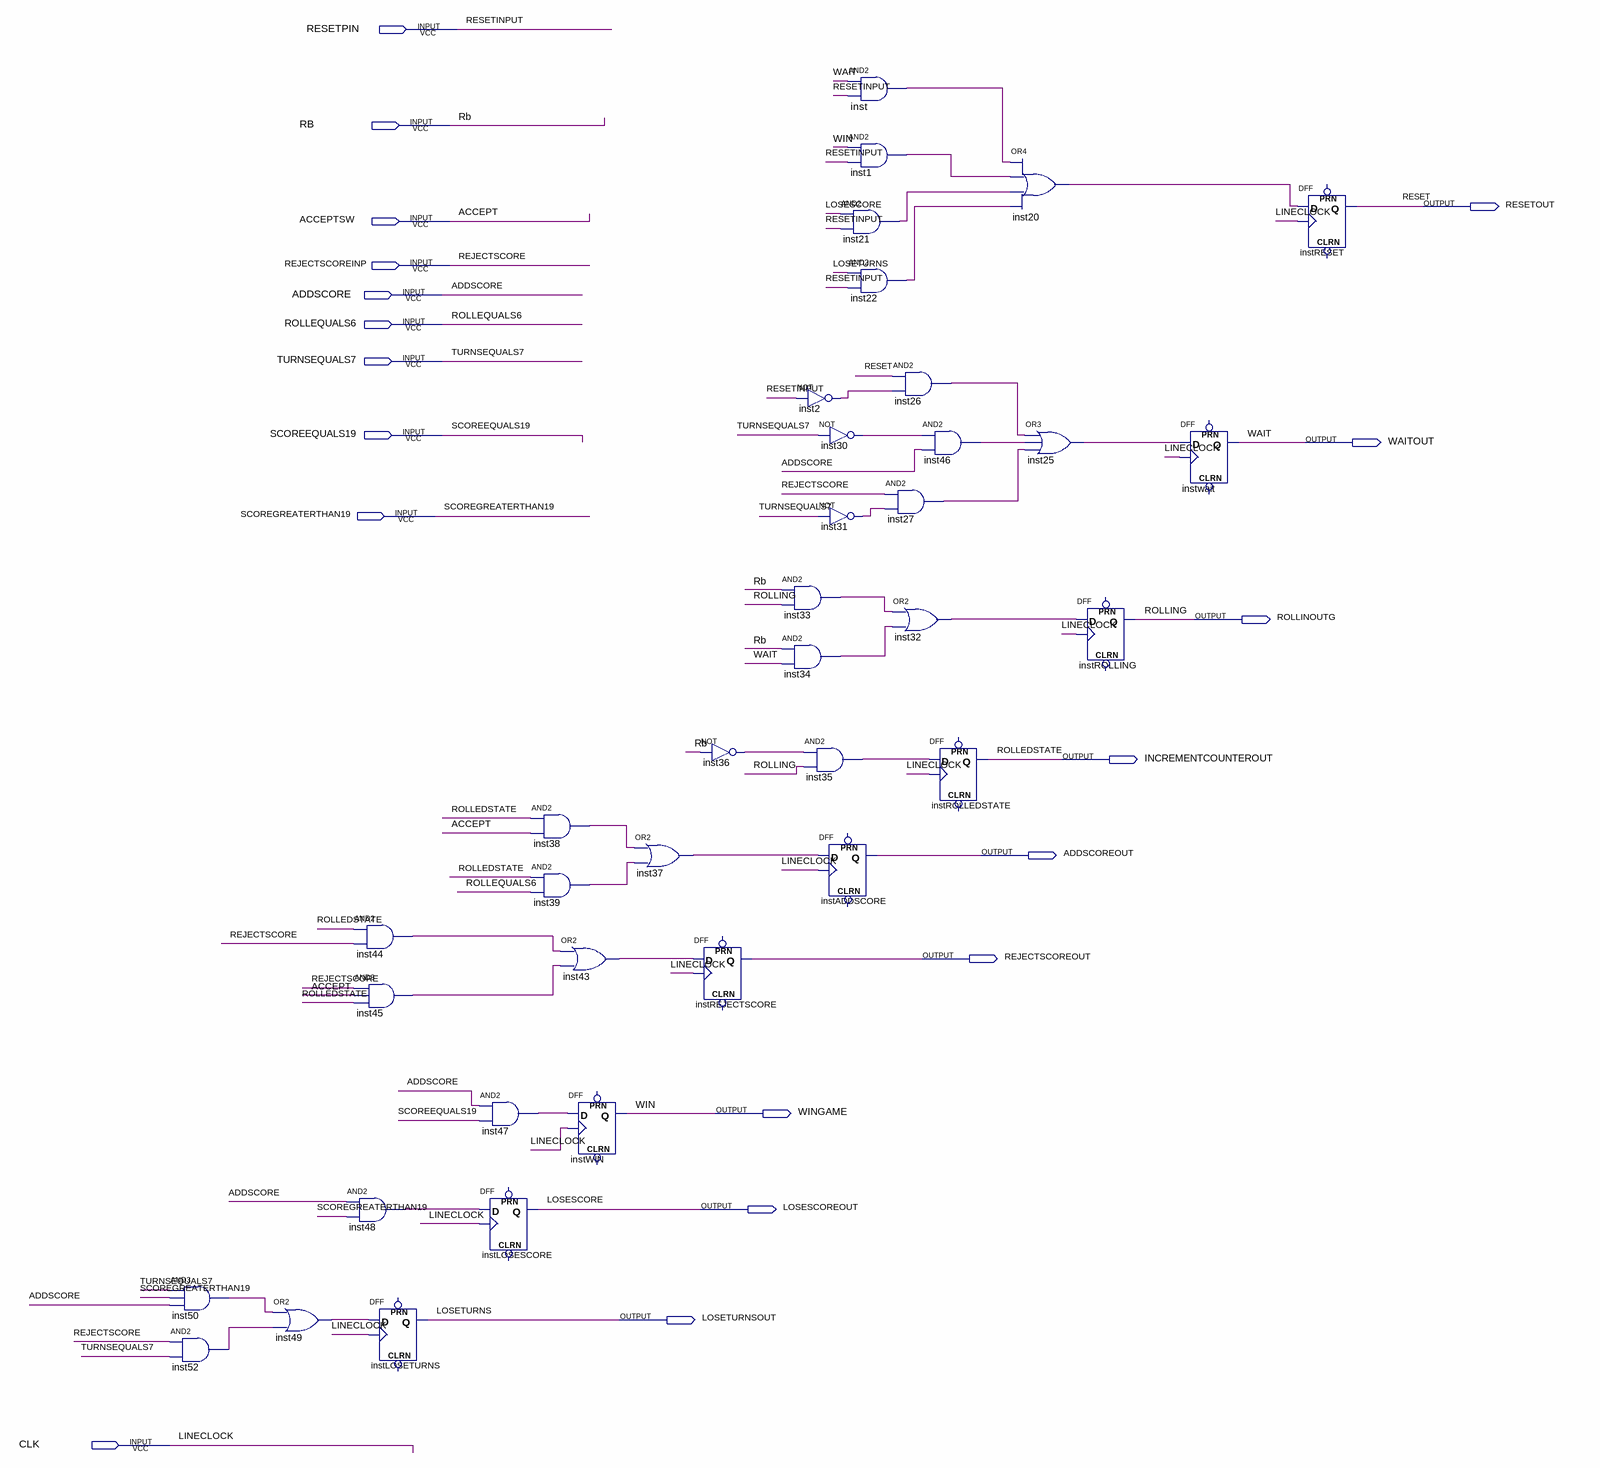
[diagram p0: schematic sheet]
// Quartus schematic Control.bdf as structural Verilog: 37 symbols, 19 pins
module Control (
  input  RESETPIN,
  input  RB,
  input  ACCEPTSW,
  input  REJECTSCOREINP,
  input  ADDSCORE,
  input  ROLLEQUALS6,
  input  TURNSEQUALS7,
  input  SCOREEQUALS19,
  input  SCOREGREATERTHAN19,
  input  CLK,
  output RESETOUT,
  output WAITOUT,
  output ROLLINOUTG,
  output INCREMENTCOUNTEROUT,
  output ADDSCOREOUT,
  output REJECTSCOREOUT,
  output WINGAME,
  output LOSESCOREOUT,
  output LOSETURNSOUT
);

  wire inst1_out, inst2_out, inst20_out, inst21_out, inst22_out, inst25_out, inst26_out, inst27_out,
       inst30_out, inst31_out, inst32_out, inst33_out, inst34_out, inst35_out, inst36_out, inst37_out,
       inst38_out, inst39_out, inst43_out, inst44_out, inst45_out, inst46_out, inst47_out, inst48_out,
       inst49_out, inst50_out, inst52_out, inst_out;

  and inst50 (inst50_out, TURNSEQUALS7, SCOREGREATERTHAN19, ADDSCORE);
  and inst52 (inst52_out, REJECTSCOREINP, TURNSEQUALS7);
  or inst49 (inst49_out, inst50_out, inst52_out);
  and inst44 (inst44_out, INCREMENTCOUNTEROUT, REJECTSCOREINP);
  and inst45 (inst45_out, REJECTSCOREINP, ACCEPTSW, INCREMENTCOUNTEROUT);
  and inst48 (inst48_out, ADDSCORE, SCOREGREATERTHAN19);
  DFF instLOSETURNS (.CLK(CLK), .D(inst49_out), .Q(LOSETURNSOUT));  // open: CLRN, PRN
  and inst47 (inst47_out, ADDSCORE, SCOREEQUALS19);
  DFF instLOSESCORE (.CLK(CLK), .D(inst48_out), .Q(LOSESCOREOUT));  // open: CLRN, PRN
  and inst38 (inst38_out, INCREMENTCOUNTEROUT, ACCEPTSW);
  and inst39 (inst39_out, INCREMENTCOUNTEROUT, ROLLEQUALS6);
  or inst43 (inst43_out, inst44_out, inst45_out);
  DFF instWIN (.CLK(CLK), .D(inst47_out), .Q(WINGAME));  // open: CLRN, PRN
  or inst37 (inst37_out, inst38_out, inst39_out);
  not inst36 (inst36_out, RB);
  DFF instREJECTSCORE (.CLK(CLK), .D(inst43_out), .Q(REJECTSCOREOUT));  // open: CLRN, PRN
  not inst2 (inst2_out, RESETPIN);
  not inst30 (inst30_out, TURNSEQUALS7);
  not inst31 (inst31_out, TURNSEQUALS7);
  and inst33 (inst33_out, RB, ROLLINOUTG);
  and inst34 (inst34_out, RB, WAITOUT);
  and inst35 (inst35_out, inst36_out, ROLLINOUTG);
  DFF instADDSCORE (.CLK(CLK), .D(inst37_out), .Q(ADDSCOREOUT));  // open: CLRN, PRN
  and inst (inst_out, WAITOUT, RESETPIN);
  and inst1 (inst1_out, WINGAME, RESETPIN);
  and inst21 (inst21_out, LOSESCOREOUT, RESETPIN);
  and inst22 (inst22_out, LOSETURNSOUT, RESETPIN);
  and inst26 (inst26_out, RESETOUT, inst2_out);
  and inst27 (inst27_out, REJECTSCOREINP, inst31_out);
  or inst32 (inst32_out, inst33_out, inst34_out);
  and inst46 (inst46_out, inst30_out, ADDSCORE);
  DFF instROLLEDSTATE (.CLK(CLK), .D(inst35_out), .Q(INCREMENTCOUNTEROUT));  // open: CLRN, PRN
  or inst20 (inst20_out, inst_out, inst1_out, inst21_out, inst22_out);
  or inst25 (inst25_out, inst26_out, inst46_out, inst27_out);
  DFF instROLLING (.CLK(CLK), .D(inst32_out), .Q(ROLLINOUTG));  // open: CLRN, PRN
  DFF instwait (.CLK(CLK), .D(inst25_out), .Q(WAITOUT));  // open: CLRN, PRN
  DFF instRESET (.CLK(CLK), .D(inst20_out), .Q(RESETOUT));  // open: CLRN, PRN

  // Other names for the same wires on the sheet: ACCEPT = ACCEPTSW; LINECLOCK = CLK; LOSESCORE = LOSESCOREOUT;
  //   LOSETURNS = LOSETURNSOUT; REJECTSCORE = REJECTSCOREINP; RESET = RESETOUT; RESETINPUT = RESETPIN;
  //   ROLLEDSTATE = INCREMENTCOUNTEROUT; ROLLING = ROLLINOUTG; WAIT = WAITOUT; WIN = WINGAME
endmodule
